# EAGLE schematic Terrariumsteuerung (EAGLE 9.6.2)
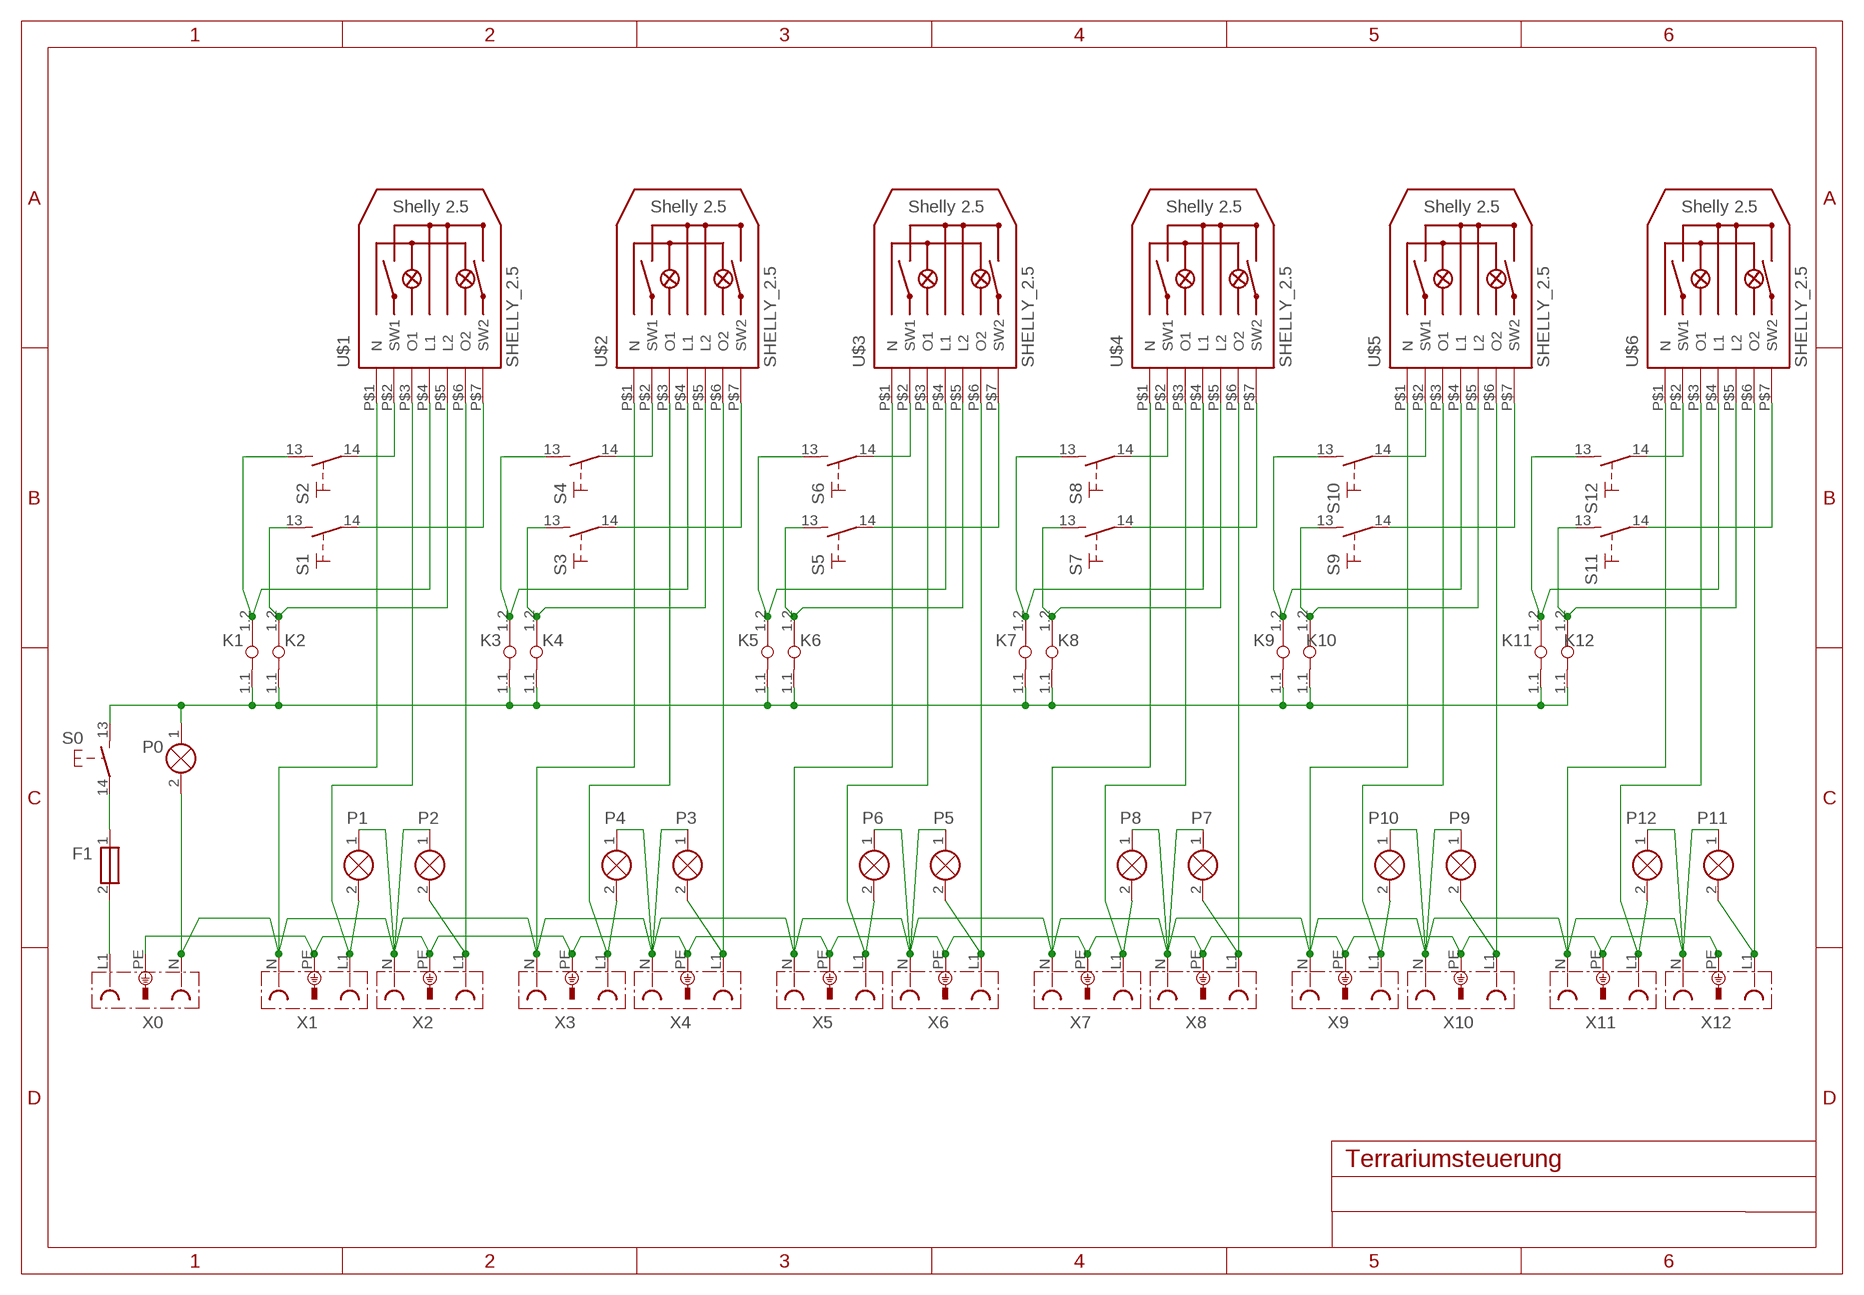
[diagram p0: schematic, sheet 1]

## Parts
F1  SICHERUNG_1-POL  [SICHERUNG_1-POL]
K1  KLEMME_1-1  [KLEMME_1-1]
K2  KLEMME_1-1  [KLEMME_1-1]
K3  KLEMME_1-1  [KLEMME_1-1]
K4  KLEMME_1-1  [KLEMME_1-1]
K5  KLEMME_1-1  [KLEMME_1-1]
K6  KLEMME_1-1  [KLEMME_1-1]
K7  KLEMME_1-1  [KLEMME_1-1]
K8  KLEMME_1-1  [KLEMME_1-1]
K9  KLEMME_1-1  [KLEMME_1-1]
K10  KLEMME_1-1  [KLEMME_1-1]
K11  KLEMME_1-1  [KLEMME_1-1]
K12  KLEMME_1-1  [KLEMME_1-1]
P0  SIGNALLAMPE  [LAMPE]
P1  SIGNALLAMPE  [LAMPE]
P2  SIGNALLAMPE  [LAMPE]
P3  SIGNALLAMPE  [LAMPE]
P4  SIGNALLAMPE  [LAMPE]
P5  SIGNALLAMPE  [LAMPE]
P6  SIGNALLAMPE  [LAMPE]
P7  SIGNALLAMPE  [LAMPE]
P8  SIGNALLAMPE  [LAMPE]
P9  SIGNALLAMPE  [LAMPE]
P10  SIGNALLAMPE  [LAMPE]
P11  SIGNALLAMPE  [LAMPE]
P12  SIGNALLAMPE  [LAMPE]
S0  TASTER_SCHLIESSER  [EINTASTER]
S1  SCHLIESSER_KIPPSCHALTER  [SCHLIESSER_KIPPSCHALTER]
S2  SCHLIESSER_KIPPSCHALTER  [SCHLIESSER_KIPPSCHALTER]
S3  SCHLIESSER_KIPPSCHALTER  [SCHLIESSER_KIPPSCHALTER]
S4  SCHLIESSER_KIPPSCHALTER  [SCHLIESSER_KIPPSCHALTER]
S5  SCHLIESSER_KIPPSCHALTER  [SCHLIESSER_KIPPSCHALTER]
S6  SCHLIESSER_KIPPSCHALTER  [SCHLIESSER_KIPPSCHALTER]
S7  SCHLIESSER_KIPPSCHALTER  [SCHLIESSER_KIPPSCHALTER]
S8  SCHLIESSER_KIPPSCHALTER  [SCHLIESSER_KIPPSCHALTER]
S9  SCHLIESSER_KIPPSCHALTER  [SCHLIESSER_KIPPSCHALTER]
S10  SCHLIESSER_KIPPSCHALTER  [SCHLIESSER_KIPPSCHALTER]
S11  SCHLIESSER_KIPPSCHALTER  [SCHLIESSER_KIPPSCHALTER]
S12  SCHLIESSER_KIPPSCHALTER  [SCHLIESSER_KIPPSCHALTER]
U$1  SHELLY_2.5  [SHELLY_2.5]
U$2  SHELLY_2.5  [SHELLY_2.5]
U$3  SHELLY_2.5  [SHELLY_2.5]
U$4  SHELLY_2.5  [SHELLY_2.5]
U$5  SHELLY_2.5  [SHELLY_2.5]
U$6  SHELLY_2.5  [SHELLY_2.5]
X0  STECKDOSE  [STECKDOSE]
X1  STECKDOSE  [STECKDOSE]
X2  STECKDOSE  [STECKDOSE]
X3  STECKDOSE  [STECKDOSE]
X4  STECKDOSE  [STECKDOSE]
X5  STECKDOSE  [STECKDOSE]
X6  STECKDOSE  [STECKDOSE]
X7  STECKDOSE  [STECKDOSE]
X8  STECKDOSE  [STECKDOSE]
X9  STECKDOSE  [STECKDOSE]
X10  STECKDOSE  [STECKDOSE]
X11  STECKDOSE  [STECKDOSE]
X12  STECKDOSE  [STECKDOSE]

## Nets
N$1: F1.2 X0.L1
N$2: F1.1 S0.14
N$3: K1.1.1 K2.1.1 K3.1.1 K4.1.1 K5.1.1 K6.1.1 K7.1.1 K8.1.1 K9.1.1 K10.1.1 K11.1.1 K12.1.1 P0.1(X1) S0.13
N$4: X0.PE X1.PE X2.PE X3.PE X4.PE X5.PE X6.PE X7.PE X8.PE X9.PE X10.PE X11.PE X12.PE
N$5: P4.2(X2) U$2.P$3(O1) X3.L1
N$6: P3.2(X2) U$2.P$6(O2) X4.L1
N$8: S3.14 U$2.P$7(SW2)
N$10: S4.14 U$2.P$2(SW1)
N$11: K3.1.2 S4.13 U$2.P$4(L1)
N$12: K4.1.2 S3.13 U$2.P$5(L2)
N$13: S2.14 U$1.P$2(SW1)
N$14: P1.2(X2) U$1.P$3(O1) X1.L1
N$15: P2.2(X2) U$1.P$6(O2) X2.L1
N$16: P0.2(X2) P1.1(X1) P2.1(X1) P3.1(X1) P4.1(X1) P5.1(X1) P6.1(X1) P7.1(X1) P8.1(X1) P9.1(X1) P10.1(X1) P11.1(X1) P12.1(X1) U$1.P$1(N) U$2.P$1(N) U$3.P$1(N) U$4.P$1(N) U$5.P$1(N) U$6.P$1(N) X0.N X1.N X2.N X3.N X4.N X5.N X6.N X7.N X8.N X9.N X10.N X11.N X12.N
N$17: S1.14 U$1.P$7(SW2)
N$18: K1.1.2 S2.13 U$1.P$4(L1)
N$20: K2.1.2 S1.13 U$1.P$5(L2)
N$22: P6.2(X2) U$3.P$3(O1) X5.L1
N$23: P5.2(X2) U$3.P$6(O2) X6.L1
N$25: S5.14 U$3.P$7(SW2)
N$26: S6.14 U$3.P$2(SW1)
N$27: K5.1.2 S6.13 U$3.P$4(L1)
N$28: K6.1.2 S5.13 U$3.P$5(L2)
N$31: P8.2(X2) U$4.P$3(O1) X7.L1
N$32: P7.2(X2) U$4.P$6(O2) X8.L1
N$34: S7.14 U$4.P$7(SW2)
N$35: S8.14 U$4.P$2(SW1)
N$36: K7.1.2 S8.13 U$4.P$4(L1)
N$37: K8.1.2 S7.13 U$4.P$5(L2)
N$40: P10.2(X2) U$5.P$3(O1) X9.L1
N$41: P9.2(X2) U$5.P$6(O2) X10.L1
N$43: S9.14 U$5.P$7(SW2)
N$44: S10.14 U$5.P$2(SW1)
N$45: K9.1.2 S10.13 U$5.P$4(L1)
N$46: K10.1.2 S9.13 U$5.P$5(L2)
N$49: P12.2(X2) U$6.P$3(O1) X11.L1
N$50: P11.2(X2) U$6.P$6(O2) X12.L1
N$52: S11.14 U$6.P$7(SW2)
N$53: S12.14 U$6.P$2(SW1)
N$54: K11.1.2 S12.13 U$6.P$4(L1)
N$55: K12.1.2 S11.13 U$6.P$5(L2)

## Library data of the parts
F1 = e-sicherungen:SICHERUNG_1-POL: Sicherung, 1-pol.
K1-K12 = e-klemmen:KLEMME_1-1: Klemme 1 Pol.
P0 P1-P12 = e-lampen-signalisation:SIGNALLAMPE: Lampe
S0 = e-schalter:TASTER_SCHLIESSER: Ein-Taster (Arbeitskontakt)
S1-S12 = e-schalter:SCHLIESSER_KIPPSCHALTER: Kippschalter, Schließer
U$1-U$6 = Shelly_2.5:SHELLY_2.5
X0 X1-X12 = e-steckverbinder:STECKDOSE: Steckdose mit Schutzleiter